# Altium schematic sheet power.SchDoc: OPO
size Letter; Author: Kuo, Huang; Revision: 4.0; SheetNumber: 4; SheetTotal: 7
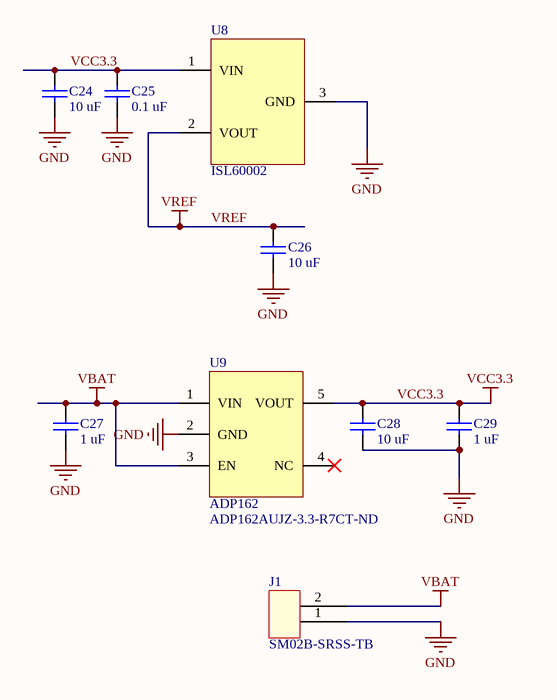
[diagram p0: power.SchDoc]

## Parts
C24  value 10 uF  [0603]  (hidden comment: Ceramic capacitor)
C25  value 0.1 uF  [0402]  (hidden comment: Ceramic capacitor)
C26  value 10 uF  [0603]  (hidden comment: Ceramic capacitor)
C27  value 1 uF  [0402]  (hidden comment: Ceramic capacitor)
C28  value 10 uF  [0603]  (hidden comment: Ceramic capacitor)
C29  value 1 uF  [0402]  (hidden comment: Ceramic capacitor)
J1  SM02B-SRSS-TB  [JST SH series]
U8  ISL60002  [SOT23-3N]
U9  ADP162  Supplier Part Number 1: ADP162AUJZ-3.3-R7CT-ND  [TSOT23-5]

## Nets
GND: C24.2 C25.2 C26.2 C27.2 C28.2 C29.2 J1.1 U8.3(GND) U9.2(GND)
VBAT: C27.1 J1.2 U9.1(VIN) U9.3(EN)
VCC3.3: C24.1 C25.1 C28.1 C29.1 U8.1(VIN) U9.5(VOUT)
VREF: C26.1 U8.2(VOUT)

Not connected (* = marked no-connect by the designer): U9 4(NC)*

## Notes on the sheet
- Title
- Date:
- Author:
- Revision:
- Sheet
- of
- University of Michigan
- File:

## Library data of the parts
C24 C26 C28 = C_10u_0603_ceramic: Ceramic capacitor, 10 uF, 0603 package; Manufacture: TDK; voltage rated: 6.3V; tolerance: 20%; package: 0603; Supplier 1: Digi-Key; Supplier Part Number 1: 445-4112-1-ND
C25 = C_0.1u_0402_ceramic: Ceramic capacitor, 0.1u, 0402 package; Manufacture: TDK; voltage rated: 10 V; tolerance: 10%; Supplier 1: Digi-Key; Supplier Part Number 1: 445-1265-1-ND; package: 0402
C27 C29 = C_1u_0402_ceramic: Ceramic capacitor, 1 uF, 0402 package; Manufacture: TDK; voltage rated: 6.3 V; tolerance: 10%; package: 0402; Supplier 1: Digi-Key; Supplier Part Number 1: 445-5000-1-ND
J1 = SM02B-SRSS-TB: CONN HEADER SH 2POS SIDE 1MM TIN; Supplier 1: Digi-Key; Supplier Part Number 1: 455-1802-1-ND
U8 = ISL60002: IC VREF SERIES PREC SOT-23-3; Supplier 1: Digi-Key; Supplier Part Number 1: ISL60002DIH310Z-TKCT-ND
U9 = ADP162: Ultralow Quiescent Current,  150 mA, CMOS Linear Regulators; Supplier 1: Digi-Key